# Altium schematic sheet SunS_Decoupler (Kopia powodująca konflikty (użytkownik Michał Gumiela) 2015-04-06).SchDoc
size A4
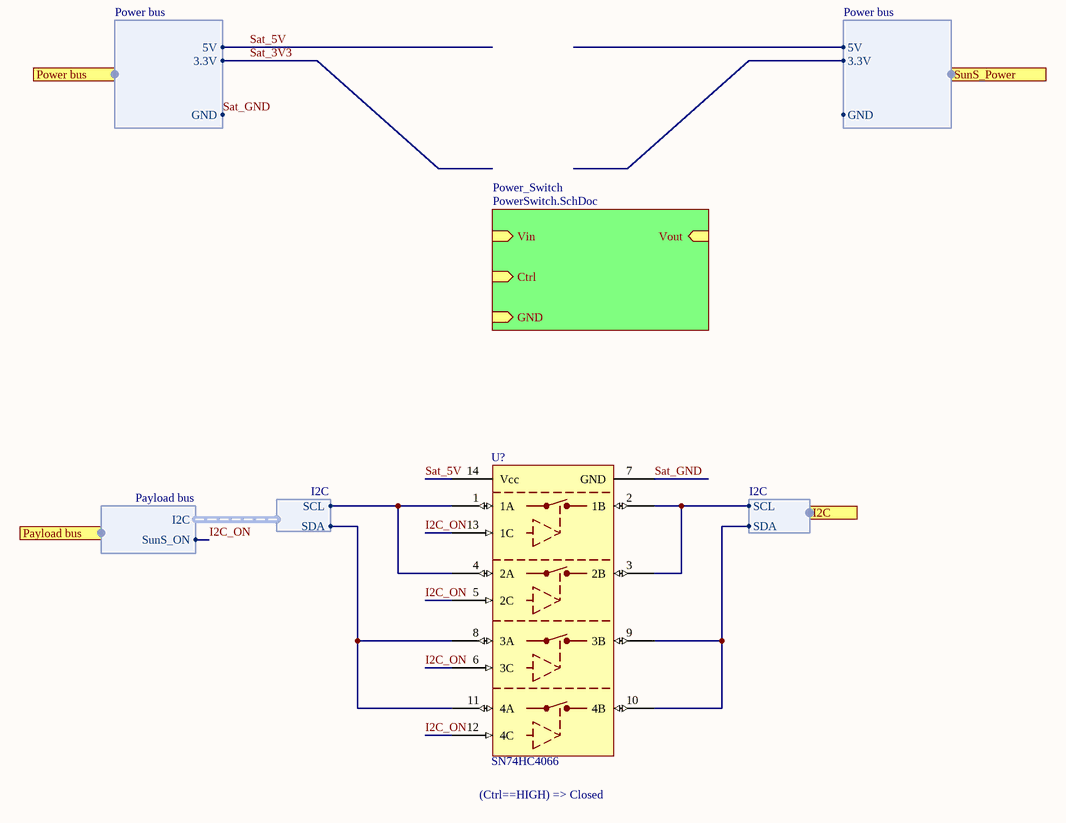
[diagram p0: SunS_Decoupler (Kopia powodująca konflikty (użytkownik Michał Gumiela) 2015-04-06).SchDoc]

## Parts
U?  SN74HC4066  [TSSOP14_L]

## Sub-sheets
Power_Switch = PowerSwitch.SchDoc: Vin (in), Ctrl (in), Vout (in), GND (in)

## Ports
I2C (harness I2C), Payload bus (harness Payload bus), Power bus (harness Power bus), SunS_Power (harness Power bus)

## Harnesses
I2C: SCL, SDA
Payload bus: I2C, SunS_ON
Power bus: 5V, GND, 3.3V

## Nets
I2C_ON: U?.5(2C) U?.6(3C) U?.12(4C) U?.13(1C) ; port Payload bus.SunS_ON
Sat_3V3: port Power bus.3.3V
Sat_5V: U?.14(Vcc) ; port Power bus.5V
Sat_GND: U?.7(GND) ; port Power bus.GND
NetU?_1: U?.1(1A) U?.4(2A) ; harness I2C.SCL
NetU?_2: U?.2(1B) U?.3(2B) ; port I2C.SCL
NetU?_8: U?.8(3A) U?.11(4A) ; harness I2C.SDA
NetU?_9: U?.9(3B) U?.10(4B) ; port I2C.SDA

## Notes on the sheet
- (Ctrl==HIGH) => Closed

## Library data of the parts
U? = SN74HC4066: Quadruple bilateral analog switch